# EAGLE design lab5_v1 (EAGLE 6.5.0)
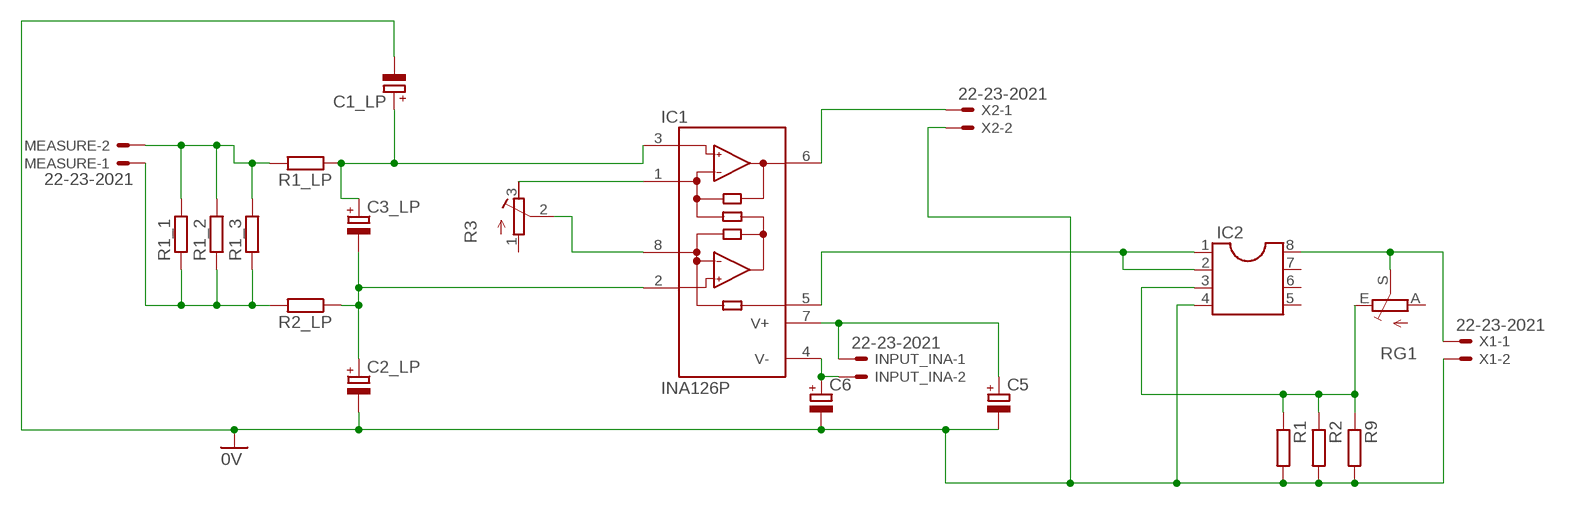
[diagram p0: schematic, sheet 1]

## Parts
C1_LP  CPOL-EUE5-10.5  [E5-10,5]
C2_LP  CPOL-EUE5-10.5  [E5-10,5]
C3_LP  CPOL-EUE5-10.5  [E5-10,5]
C5  CPOL-EUE5-10.5  [E5-10,5]
C6  CPOL-EUE5-10.5  [E5-10,5]
IC1  INA126P  [DIL08]
IC2  DIL8  [DIL08]
INPUT_INA  22-23-2021  [22-23-2021]
MEASURE  22-23-2021  [22-23-2021]
R1  R-EU_0207/7  [0207/7]
R1_1  R-EU_0617/22  [0617/22]
R1_2  R-EU_0617/22  [0617/22]
R1_3  R-EU_0617/22  [0617/22]
R1_LP  R-EU_0207/7  [0207/7]
R2  R-EU_0207/7  [0207/7]
R2_LP  R-EU_0207/7  [0207/7]
R3  R-TRIMM64X  [RTRIM64X]
R9  R-EU_0207/7  [0207/7]
RG1  TRIM_EU-B25P  [B25P]
X1  22-23-2021  [22-23-2021]
X2  22-23-2021  [22-23-2021]

## Nets
+5V_1: C5.+ IC1.7(V+) INPUT_INA.1
GND: C1_LP.- C2_LP.- C5.- C6.- IC2.4 R1.2 R2.2 R9.2 X1.2 X2.2 ; supply symbol labelled 0V
N$1: C1_LP.+ C3_LP.+ IC1.3(+IN) R1_LP.1
N$2: C2_LP.+ C3_LP.- IC1.2(-IN) R2_LP.1
N$3: IC1.8(RG) R3.2(S)
N$4: IC1.1(RG) R3.3(A)
N$5: IC2.8 RG1.S X1.1
N$6: IC1.5(REF) IC2.1 IC2.2
N$7: IC2.3 R1.1 R2.1 R9.1 RG1.E
N$8: MEASURE.1 R1_1.1 R1_2.1 R1_3.1 R2_LP.2
N$9: MEASURE.2 R1_1.2 R1_2.2 R1_3.2 R1_LP.2
N$10: IC1.6(OUT) X2.1
N$11: C6.+ IC1.4(V-) INPUT_INA.2
Unconnected: IC2.5 IC2.6 IC2.7 R3.1(E) RG1.A

## Library data of the parts
C1_LP C2_LP C3_LP C5 C6 = resistor:CPOL-EU: POLARIZED CAPACITOR, European symbol
IC1 = burr-brown:INA126: Instrumentation Amplifier Micropower, Single and Dual Versions; MF: TEXAS INSTRUMENT CONNECTORS; MPN: INA126P; OC_FARNELL: 1509595; OC_NEWARK: 74C9780
IC2 = ic-package:DIL8: Dual In Line / Socket
INPUT_INA MEASURE X1 X2 = con-molex:22-23-2021: .100" (2.54mm) Center Header - 2 Pin; MF: MOLEX; MPN: 22-23-2021; OC_FARNELL: 1462926; OC_NEWARK: 25C3832
R1 R1_1-R1_3 R1_LP R2 R2_LP R9 = resistor:R-EU_: RESISTOR, European symbol
R3 = resistor:R-TRIMM: Trimm resistor
RG1 = pot:TRIM_EU-: POTENTIOMETER

## Board
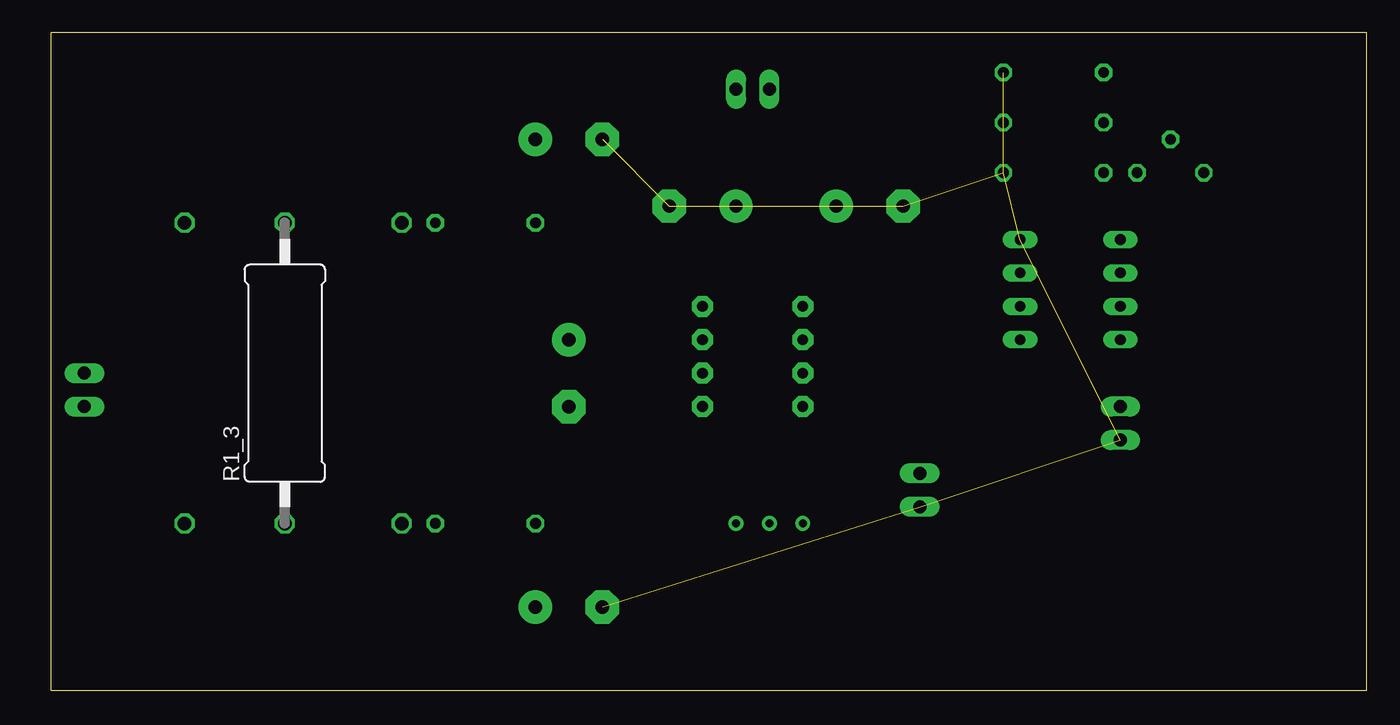
[diagram p1: board, top side]
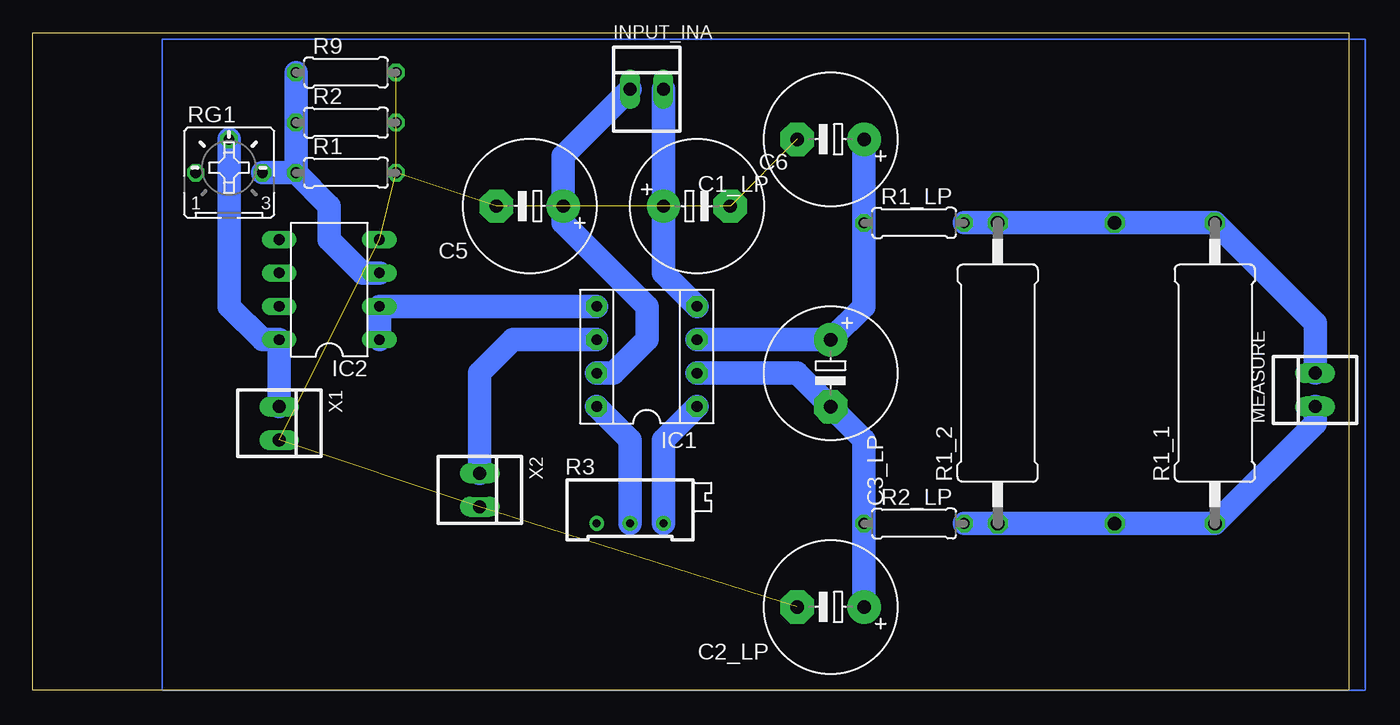
[diagram p2: board, bottom side, seen from below]

Size 100 x 50 mm. Coordinates in mm from the lower left corner, seen from the top.
Outline: 0,0 100,0 100,50 0,50 0,0
Copper layers (1*16): Top 0.035mm / dielectric 1.5mm / Bottom 0.035mm
Design rules "default": minimum track width 10mil, minimum drill 24mil, track to track 8mil, track to pad 8mil, pad to pad 8mil, via to via 8mil, smd to smd 8mil, copper to edge 40mil, drill to drill 8mil, minimum pad ring 10mil, minimum via ring 8mil, stop-mask expansion 4mil, vias tented up to drill 0mil, thermal gap 10mil

### Footprints (pad centres in the part's own frame; a part is rotated, then mirrored left to right if it is on the bottom)
E5-10,5 = drill 1.016 pad 2.54: + -2.54,0 | drill 1.016 pad 2.54 octagon: - 2.54,0
DIL08 = drill 0.813 pad 1.6 octagon: 1 -3.81,-3.81; 2 -1.27,-3.81; 3 1.27,-3.81; 4 3.81,-3.81; 5 3.81,3.81; 6 1.27,3.81; 7 -1.27,3.81; 8 -3.81,3.81
DIL08' = drill 0.813 long: 1 -3.81,-3.81; 2 -1.27,-3.81; 3 1.27,-3.81; 4 3.81,-3.81; 5 3.81,3.81; 6 1.27,3.81; 7 -1.27,3.81; 8 -3.81,3.81
22-23-2021 = drill 1 long: 1 -1.27,0; 2 1.27,0
0207/7 = drill 0.813 octagon: 1 -3.81,0; 2 3.81,0
0617/22 = drill 1.016 octagon: 1 -11.43,0; 2 11.43,0
RTRIM64X = drill 0.61: 1 1.27,-2.54; 2 1.27,0; 3 1.27,2.54
B25P = drill 0.813 octagon: A -2.54,0; E 2.54,0; S 0,2.54

### Placement (x,y rotation side)
C1_LP  39.37,41.91 180 bottom
C2_LP  39.37,6.35 180 bottom
C3_LP  39.37,24.13 270 bottom
C5  62.23,36.83 180 bottom
C6  49.53,36.83 0 bottom
IC1  53.34,25.4 90 bottom
IC2  [DIL08']  77.47,30.48 90 bottom
INPUT_INA  53.34,45.72 0 bottom
MEASURE  2.54,22.86 90 bottom
R1  76.2,39.37 0 bottom
R1_1  10.16,24.13 90 bottom
R1_2  26.67,24.13 90 bottom
R1_3  17.78,24.13 90 top
R1_LP  33.02,35.56 0 bottom
R2  76.2,43.18 0 bottom
R2_LP  33.02,12.7 0 bottom
R3  54.61,13.97 270 bottom
R9  76.2,46.99 0 bottom
RG1  85.09,39.37 0 bottom
X1  81.28,20.32 270 bottom
X2  66.04,15.24 270 bottom

### Tracks (layer width: path | path; a pad name or v marks a point on that pad's centre or on a via)
+5V_1
  Bottom 1.778: INPUT_INA.1 59.69,40.64 C5.+ 59.69,35.56 53.34,29.21 53.34,26.67 55.88,24.13 IC1.7
GND  (9 unrouted)
N$1
  Bottom 1.778: C1_LP.+ R1_LP.1 36.83,29.21 C3_LP.+ IC1.3
N$2
  Bottom 1.778: C2_LP.+ R2_LP.1 36.83,19.05 C3_LP.- 41.91,24.13 IC1.2
N$3
  Bottom 1.778: R3.2 54.61,19.05 IC1.8
N$4
  Bottom 1.778: R3.3 52.07,19.05 IC1.1
N$5
  Bottom 1.778: X1.1 IC2.8 82.55,26.67 85.09,29.21 RG1.S
N$6
  Bottom 1.778: IC1.5 IC2.2 IC2.1
N$7
  Bottom 1.778: IC2.3 74.93,31.75 77.47,34.29 77.47,36.83 R1.1 | R1.1 RG1.E | R9.1 R2.1 R1.1
N$8
  Bottom 1.778: R2_LP.2 R1_2.1 R1_3.1 R1_1.1 2.54,20.32 MEASURE.1
N$9
  Bottom 1.778: R1_LP.2 R1_2.2 R1_3.2 R1_1.2 2.54,27.94 MEASURE.2
N$10
  Bottom 1.778: IC1.6 63.5,26.67 66.04,24.13 X2.1
N$11
  Bottom 1.778: IC1.4 52.07,31.75 C6.+ INPUT_INA.2
(copper drawn outside any net)
  shapes: Bottom area x1